# Altium schematic sheet PMIC.schdoc
size 487 x 325 mm
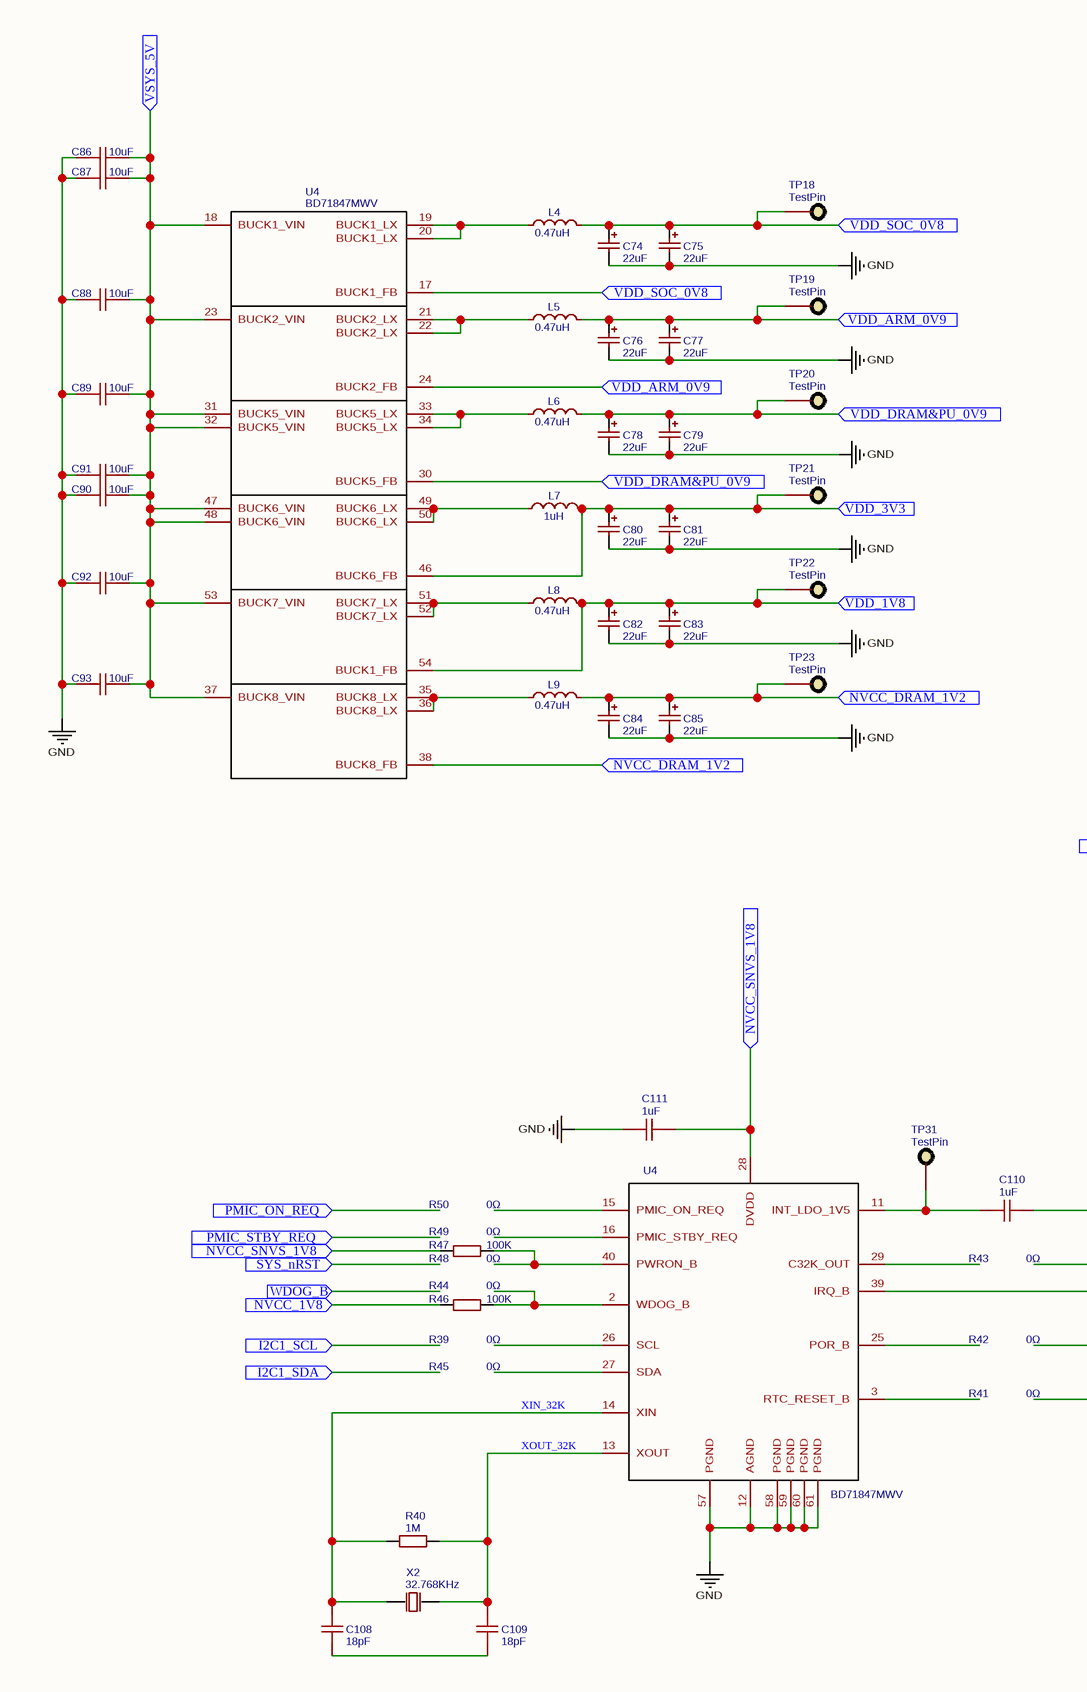
[diagram p0: PMIC.schdoc, left]
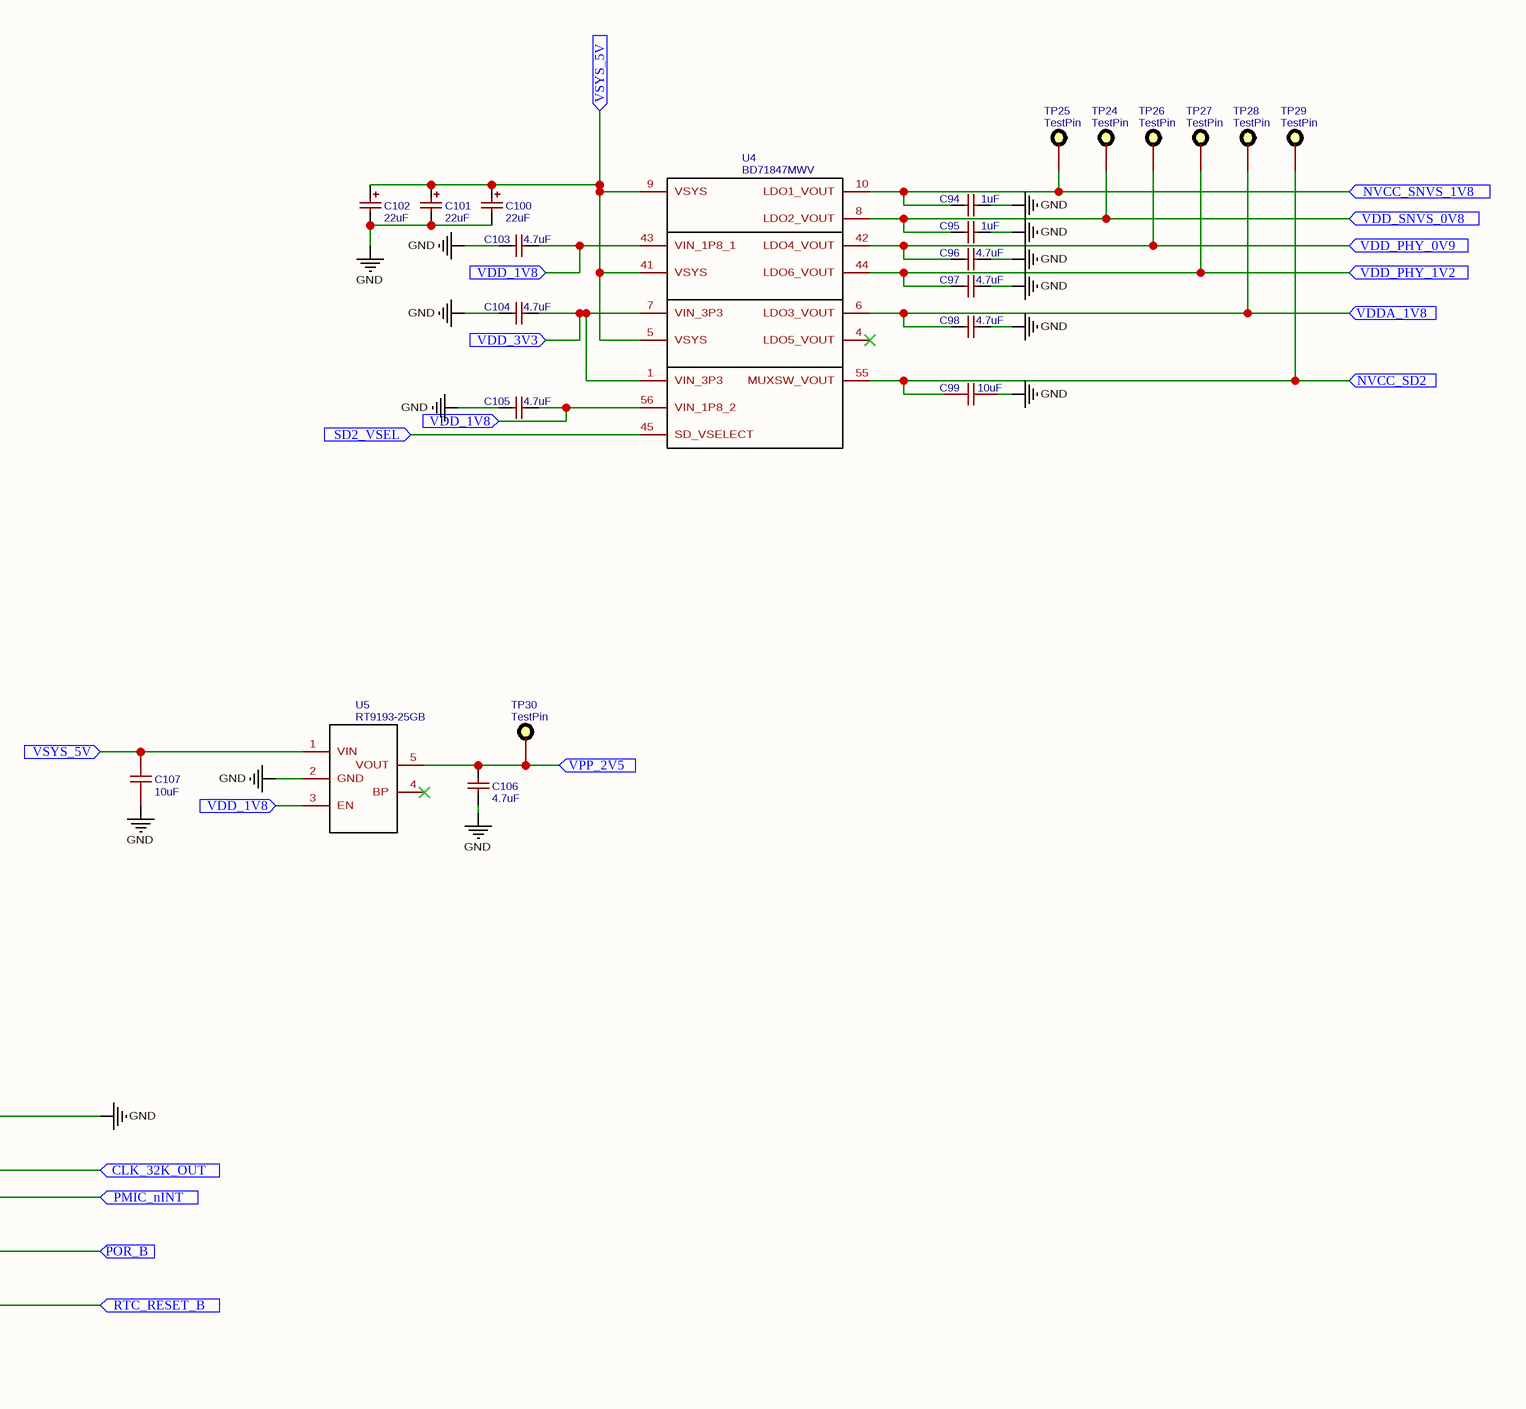
[diagram p1: PMIC.schdoc, right]

## Parts
(Parts that share a designator on the sheet are numbered #1, #2 ... from top to bottom, then left to right.)
C74  22uF  [CAP-SMD_L2.0-W1.2-R-RD]
C75  22uF  [CAP-SMD_L2.0-W1.2-R-RD]
C76  22uF  [CAP-SMD_L2.0-W1.2-R-RD]
C77  22uF  [CAP-SMD_L2.0-W1.2-R-RD]
C78  22uF  [CAP-SMD_L2.0-W1.2-R-RD]
C79  22uF  [CAP-SMD_L2.0-W1.2-R-RD]
C80  22uF  [CAP-SMD_L2.0-W1.2-R-RD]
C81  22uF  [CAP-SMD_L2.0-W1.2-R-RD]
C82  22uF  [CAP-SMD_L2.0-W1.2-R-RD]
C83  22uF  [CAP-SMD_L2.0-W1.2-R-RD]
C84  22uF  [CAP-SMD_L2.0-W1.2-R-RD]
C85  22uF  [CAP-SMD_L2.0-W1.2-R-RD]
C86  10uF  [C0805]
C87  10uF  [C0805]
C88  10uF  [C0805]
C89  10uF  [C0805]
C90  10uF  [C0805]
C91  10uF  [C0805]
C92  10uF  [C0805]
C93  10uF  [C0805]
C94  1uF  [C0402]
C95  1uF  [C0402]
C96  4.7uF  [C0402]
C97  4.7uF  [C0402]
C98  4.7uF  [C0402]
C99  10uF  [C0805]
C100  22uF  [CAP-SMD_L2.0-W1.2-R-RD]
C101  22uF  [CAP-SMD_L2.0-W1.2-R-RD]
C102  22uF  [CAP-SMD_L2.0-W1.2-R-RD]
C103  4.7uF  [C0402]
C104  4.7uF  [C0402]
C105  4.7uF  [C0402]
C106  4.7uF  [C0402]
C107  10uF  [C0805]
C108  18pF  [C0402]
C109  18pF  [C0402]
C110  1uF  [C0402]
C111  1uF  [C0402]
L4  0.47uH  [L0805]
L5  0.47uH  [L0805]
L6  0.47uH  [L0805]
L7  1uH  [L0402]
L8  0.47uH  [L0805]
L9  0.47uH  [L0805]
R39  0Ω  [1206]
R40  1M  [R0402]
R41  0Ω  [1206]
R42  0Ω  [1206]
R43  0Ω  [1206]
R44  0Ω  [1206]
R45  0Ω  [1206]
R46  100K  [R0402]
R47  100K  [R0402]
R48  0Ω  [1206]
R49  0Ω  [1206]
R50  0Ω  [1206]
TP18  TestPin  [TESTPIN]
TP19  TestPin  [TESTPIN]
TP20  TestPin  [TESTPIN]
TP21  TestPin  [TESTPIN]
TP22  TestPin  [TESTPIN]
TP23  TestPin  [TESTPIN]
TP24  TestPin  [TESTPIN]
TP25  TestPin  [TESTPIN]
TP26  TestPin  [TESTPIN]
TP27  TestPin  [TESTPIN]
TP28  TestPin  [TESTPIN]
TP29  TestPin  [TESTPIN]
TP30  TestPin  [TESTPIN]
TP31  TestPin  [TESTPIN]
U4#1  BD71847MWV  [QFN56_W7.0_L7.0_0.4P_EPAD]
U4#2  BD71847MWV  [QFN56_W7.0_L7.0_0.4P_EPAD]
U4#3  BD71847MWV  [QFN56_W7.0_L7.0_0.4P_EPAD]
U5  RT9193-25GB  [SOT-23-5]
X2  32.768KHz  [OSC-SMD_L2.0-W1.2]

## Ports
CLK_32K_OUT (in), I2C1_SCL (in), I2C1_SDA (in), NVCC_1V8 (in), NVCC_DRAM_1V2 (in), NVCC_SD2 (in), NVCC_SNVS_1V8 (in), PMIC_nINT (in), PMIC_ON_REQ (in), PMIC_STBY_REQ (in), POR_B (in), RTC_RESET_B (in), SD2_VSEL (in), SYS_nRST (in), VDD_1V8 (in), VDD_3V3 (in), VDD_ARM_0V9 (in), VDD_DRAM&PU_0V9 (in), VDD_PHY_0V9 (in), VDD_PHY_1V2 (in), VDD_SNVS_0V8 (in), VDD_SOC_0V8 (in), VDDA_1V8 (in), VPP_2V5 (in), VSYS_5V (in), WDOG_B (in)

## Nets
GND: C74.2 C75.2 C76.2 C77.2 C78.2 C79.2 C80.2 C81.2 C82.2 C83.2 C84.2 C85.2 C86.1 C87.1 C88.1 C89.1 C90.1 C91.1 C92.1 C93.1 C94.2 C95.2 C96.2 C97.2 C98.2 C99.2 C100.2 C101.2 C102.2 C103.1 C104.1 C105.1 C106.1 C107.1 C110.2 C111.1 U4#3.12(AGND) U4#3.57(PGND) U4#3.58(PGND) U4#3.59(PGND) U4#3.60(PGND) U4#3.61(PGND) U5.2(GND)
NVCC_1V8: R46.1 ; port NVCC_1V8
NVCC_DRAM_1V2: C84.1 C85.1 L9.2 TP23.1 U4#2.38(BUCK8_FB) ; port NVCC_DRAM_1V2
NVCC_SD2: C99.1 TP29.1 U4#1.55(MUXSW_VOUT) ; port NVCC_SD2
NVCC_SNVS_1V8: C94.1 C111.2 R47.1 TP25.1 U4#1.10(LDO1_VOUT) U4#3.28(DVDD) ; port NVCC_SNVS_1V8
PMIC_nINT: U4#3.39(IRQ_B) ; port PMIC_nINT
SD2_VSEL: U4#1.45(SD_VSELECT) ; port SD2_VSEL
VDD_1V8: C82.1 C83.1 C103.2 C105.2 L8.2 TP22.1 U4#1.43(VIN_1P8_1) U4#1.56(VIN_1P8_2) U4#2.54(BUCK1_FB) U5.3(EN) ; port VDD_1V8
VDD_3V3: C80.1 C81.1 C104.2 L7.2 TP21.1 U4#1.1(VIN_3P3) U4#1.7(VIN_3P3) U4#2.46(BUCK6_FB) ; port VDD_3V3
VDD_ARM_0V9: C76.1 C77.1 L5.2 TP19.1 U4#2.24(BUCK2_FB) ; port VDD_ARM_0V9
VDD_DRAM&PU_0V9: C78.1 C79.1 L6.2 TP20.1 U4#2.30(BUCK5_FB) ; port VDD_DRAM&PU_0V9
VDD_PHY_0V9: C96.1 TP26.1 U4#1.42(LDO4_VOUT) ; port VDD_PHY_0V9
VDD_PHY_1V2: C97.1 TP27.1 U4#1.44(LDO6_VOUT) ; port VDD_PHY_1V2
VDD_SNVS_0V8: C95.1 TP24.1 U4#1.8(LDO2_VOUT) ; port VDD_SNVS_0V8
VDD_SOC_0V8: C74.1 C75.1 L4.2 TP18.1 U4#2.17(BUCK1_FB) ; port VDD_SOC_0V8
VDDA_1V8: C98.1 TP28.1 U4#1.6(LDO3_VOUT) ; port VDDA_1V8
VPP_2V5: C106.2 TP30.1 U5.5(VOUT) ; port VPP_2V5
VSYS_5V: C86.2 C87.2 C88.2 C89.2 C90.2 C91.2 C92.2 C93.2 C100.1 C101.1 C102.1 C107.2 U4#1.5(VSYS) U4#1.9(VSYS) U4#1.41(VSYS) U4#2.18(BUCK1_VIN) U4#2.23(BUCK2_VIN) U4#2.31(BUCK5_VIN) U4#2.32(BUCK5_VIN) U4#2.37(BUCK8_VIN) U4#2.47(BUCK6_VIN) U4#2.48(BUCK6_VIN) U4#2.53(BUCK7_VIN) U5.1(VIN) ; port VSYS_5V
XIN_32K: C108.2 R40.1 U4#3.14(XIN) X2.1(OSC1)
XOUT_32K: C109.2 R40.2 U4#3.13(XOUT) X2.2(OSC2)
NetC108_1: C108.1 C109.1
NetC110_1: C110.1 TP31.1 U4#3.11(INT_LDO_1V5)
NetL4_1: L4.1 U4#2.19(BUCK1_LX) U4#2.20(BUCK1_LX)
NetL5_1: L5.1 U4#2.21(BUCK2_LX) U4#2.22(BUCK2_LX)
NetL6_1: L6.1 U4#2.33(BUCK5_LX) U4#2.34(BUCK5_LX)
NetL7_1: L7.1 U4#2.49(BUCK6_LX) U4#2.50(BUCK6_LX)
NetL8_1: L8.1 U4#2.51(BUCK7_LX) U4#2.52(BUCK7_LX)
NetL9_1: L9.1 U4#2.35(BUCK8_LX) U4#2.36(BUCK8_LX)
NetR46_2: R46.2 U4#3.2(WDOG_B)
NetR47_2: R47.2 U4#3.40(PWRON_B)

Not connected (* = marked no-connect by the designer): U4#1 4(LDO5_VOUT)*; U4#3 3(RTC_RESET_B) 15(PMIC_ON_REQ) 16(PMIC_STBY_REQ) 25(POR_B) 26(SCL) 27(SDA) 29(C32K_OUT); U5 4(BP)*

## Library data of the parts
C74-C85 C100-C102 = 22uF: BOM_Manufacturer: AVX; BOM_Manufacturer Part: TAJP226M006RNJ; nameAlias: Capacitance; SMT Type: Extend; BOM_Supplier: LCSC; BOM_Supplier Part: C11383; BOM_JLCPCB SMD: Yes; spicePre: C; spiceSymbolName: TAJP226M006RNJ
C86-C93 C99 C107 = 10uF: BOM_Manufacturer: FH; BOM_Manufacturer Part: 0805F106M160NT; nameAlias: Capacitance; SMT Type: Extend; BOM_Supplier: LCSC; BOM_Supplier Part: C90545; BOM_JLCPCB SMD: Yes; spicePre: C; spiceSymbolName: 0805F106M160NT
C94 C95 = 1uF: BOM_Manufacturer Part: CL05A105KP5NNNC; BOM_Manufacturer: SAMSUNG; nameAlias: Capacitance; SMT Type: Extend; BOM_Supplier: LCSC; BOM_Supplier Part: C14445; BOM_JLCPCB SMD: Yes; spicePre: C; spiceSymbolName: CL05A105KP5NNNC
C96-C98 C103-C106 = 4.7uF: BOM_Manufacturer Part: CL05A475MP5NRNC; BOM_Manufacturer: SAMSUNG; nameAlias: Capacitance; SMT Type: Basic; BOM_Supplier: LCSC; BOM_Supplier Part: C23733; BOM_JLCPCB SMD: Yes; spicePre: C; spiceSymbolName: CL05A475MP5NRNC
C108 C109 = 18pF: BOM_Manufacturer: MuRata; BOM_Manufacturer Part: GRM1555C1H180GA01D; nameAlias: Capacitance; BOM_Supplier: LCSC; BOM_Supplier Part: C81217; spicePre: C; spiceSymbolName: GRM1555C1H180GA01D
C110 C111 = 1uF: BOM_Manufacturer: SAMSUNG; BOM_Manufacturer Part: CL05A105KA5NQNC; nameAlias: Capacitance; SMT Type: Basic; BOM_Supplier: LCSC; BOM_Supplier Part: C52923; BOM_JLCPCB SMD: Yes; spicePre: C; spiceSymbolName: CL05A105KA5NQNC
L4-L6 L8 L9 = 0.47uH: BOM_Manufacturer: Murata Electronics; BOM_Manufacturer Part: LQW21HNR47J00L; nameAlias: Inductance; Contributor: LCSC; BOM_Supplier: LCSC; BOM_Supplier Part: C471382; spicePre: L; spiceSymbolName: LQW21HNR47J00L
L7 = 1uH: BOM_Manufacturer Part: SDFL1005Q1R0KTF; BOM_Manufacturer: Sunlord; nameAlias: Inductance; SMT Type: Extend; BOM_Supplier: LCSC; BOM_Supplier Part: C84468; BOM_JLCPCB SMD: Yes; spicePre: L; spiceSymbolName: SDFL1005Q1R0KTF
R39 R41-R45 R48-R50 = 0Ω: BOM_Manufacturer Part: 0R(000) ±1%; Value: 0Ω; BOM_Supplier Part: undefined; BOM_Supplier: LCSC; spicePre: R; spiceSymbolName: 0Ω
R40 = 1M: BOM_Manufacturer: UniOhm; BOM_Manufacturer Part: 0402WGF1004TCE; nameAlias: Resistance (Ohms); SMT Type: Basic; BOM_Supplier: LCSC; BOM_Supplier Part: C26083; BOM_JLCPCB SMD: Yes; spicePre: R; spiceSymbolName: 0402WGF1004TCE
R46 R47 = 100K: BOM_Manufacturer: UniOhm; BOM_Manufacturer Part: 0402WGF1003TCE; nameAlias: Resistance (Ohms); SMT Type: Basic; BOM_Supplier: LCSC; BOM_Supplier Part: C25741; BOM_JLCPCB SMD: Yes; spicePre: R; spiceSymbolName: 0402WGF1003TCE
TP18-TP31 = TestPin: Contributor: alan.green; sourceId: WTb5nFXR9; timeStamp: 1460711565; spicePre: T; spiceSymbolName: TestPin
U4#1-U4#3 = BD71847MWV: BOM_Manufacturer Part: BD71847AMWV-E2; subpart_no: 1; Contributor: jem555; BOM_Supplier: RS-Online; BOM_Supplier Part: Rohm; spicePre: U; spiceSymbolName: BD71847MWV
U5 = RT9193-25GB: BOM_Manufacturer: RICHTEK; BOM_Supplier Part: undefined; BOM_Supplier: LCSC; BOM_Manufacturer Part: RT9193-25GB; spicePre: U; spiceSymbolName: RT9193-25GB
X2 = 32.768KHz: BOM_Manufacturer: KDS Daishinku; nameAlias: Frequency; Contributor: LCSC; SMT Type: Extend; BOM_Supplier: LCSC; BOM_Supplier Part: C93231; BOM_Manufacturer Part: -; BOM_JLCPCB SMD: Yes; spicePre: X; spiceSymbolName: DST210AC 32.768KHz